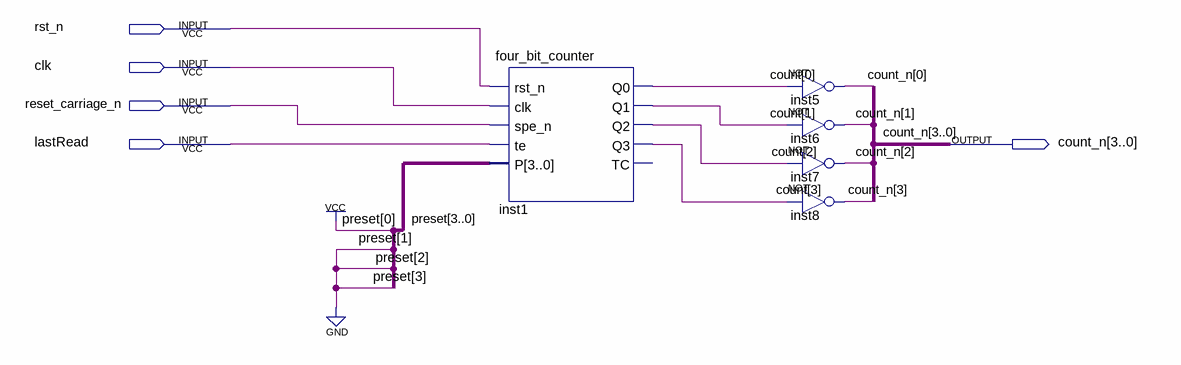
[diagram p0: schematic sheet]
// Quartus schematic counter_4bit_down.bdf as structural Verilog: 5 symbols, 5 pins
module counter_4bit_down (
  input  rst_n,
  input  clk,
  input  reset_carriage_n,
  input  lastRead,
  output [3:0] count_n
);

  wire [3:0] count;

  four_bit_counter inst1 (
    .rst_n(rst_n), .clk(clk), .spe_n(reset_carriage_n), .te(lastRead), .P(4'b0001), .Q0(count[0]),
    .Q1(count[1]), .Q2(count[2]), .Q3(count[3]));  // open: TC
  not inst5 (count_n[0], count[0]);
  not inst6 (count_n[1], count[1]);
  not inst7 (count_n[2], count[2]);
  not inst8 (count_n[3], count[3]);
endmodule
